# EAGLE design XBeeBreakOut (EAGLE 8.0.0)
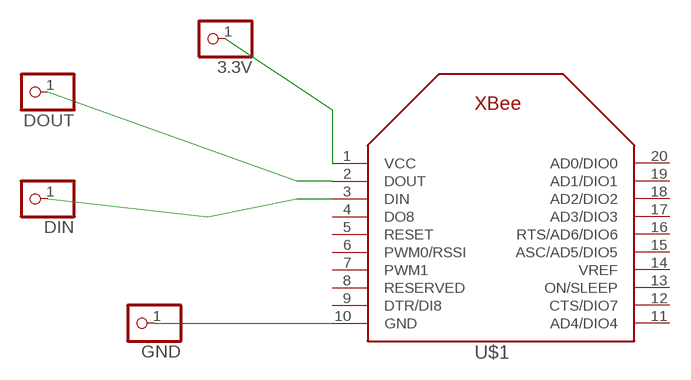
[diagram p0: schematic, sheet 1]

## Parts
3.3V  PINHD-1X1  [1X01]
DIN  PINHD-1X1  [1X01]
DOUT  PINHD-1X1  [1X01]
GND  PINHD-1X1  [1X01]
U$1  XBEE  [XBEE]

## Nets
DIN: DIN.1 U$1.3(DIN)
DOUT: DOUT.1 U$1.2(DOUT)
GND: GND.1 U$1.10(GND)
VCC: 3.3V.1 U$1.1(VCC)
Unconnected: U$1.4(DO8) U$1.5(RESET) U$1.6(PWM0/RSSI) U$1.7(PWM1) U$1.8(RESERVED) U$1.9(DTR/DI8) U$1.11(AD4/DIO4) U$1.12(CTS/DIO7) U$1.13(ON/SLEEP) U$1.14(VREF) U$1.15(ASC/AD5/DIO5) U$1.16(RTS/AD6/DIO6) U$1.17(AD3/DIO3) U$1.18(AD2/DIO2) U$1.19(AD1/DIO1) U$1.20(AD0/DIO0)

## Library data of the parts
3.3V DIN DOUT GND = adafruit:PINHD-1X1: Pin header 1x1 for 0.1" spacing With round pins
U$1 = adafruit:XBEE

## Board
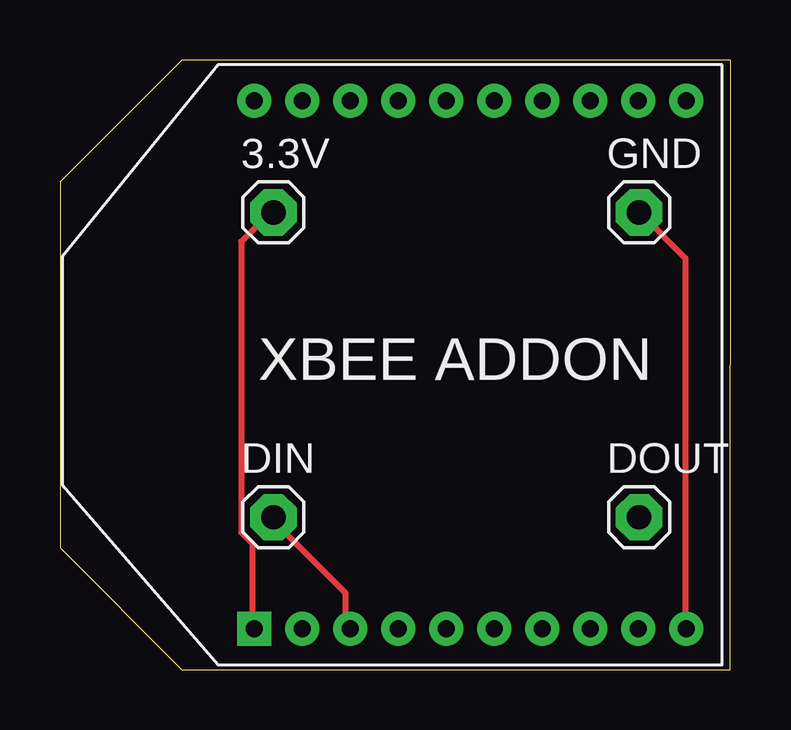
[diagram p1: board, top side]
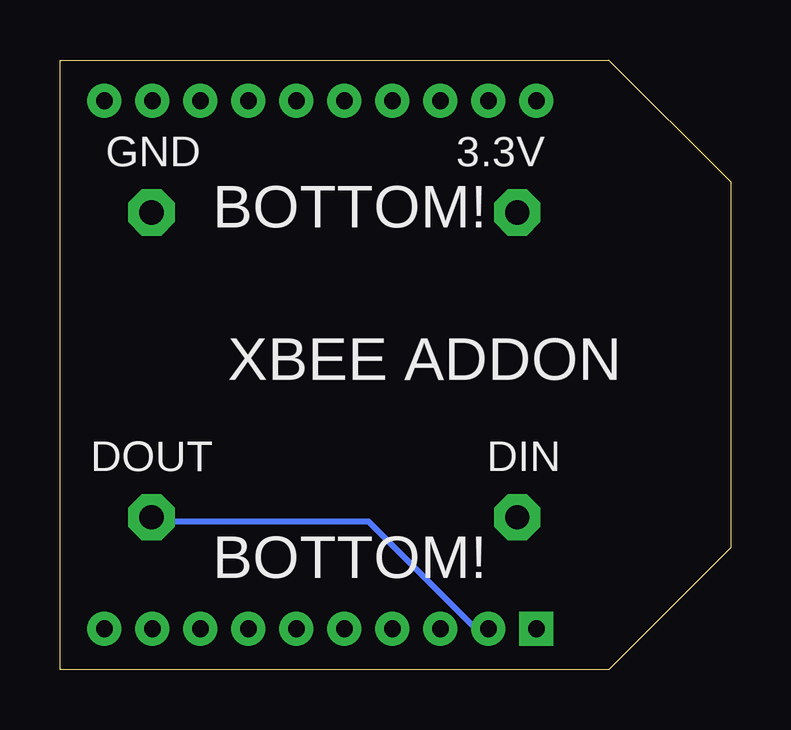
[diagram p2: board, bottom side, seen from below]

Size 27.94 x 25.4 mm. Coordinates in mm from the lower left corner, seen from the top.
Outline: 5.08,0 27.92,0 27.94,25.4 5.08,25.4 0,20.32 0,5.08 5.08,0
Copper layers (1*16): Top 0.035mm / dielectric 1.5mm / Bottom 0.035mm
Design rules "default": minimum track width 10mil, minimum drill 24mil, track to track 8mil, track to pad 8mil, pad to pad 8mil, via to via 8mil, smd to smd 8mil, copper to edge 40mil, drill to drill 8mil, minimum pad ring 10mil, minimum via ring 8mil, stop-mask expansion 4mil, vias tented up to drill 0mil, thermal gap 10mil

### Footprints (pad centres in the part's own frame; a part is rotated, then mirrored left to right if it is on the bottom)
1X01 = drill 1.016 pad 1.93 octagon: 1 0,0
XBEE = drill 0.7 pad 1.422 square: 1 -11,5.5 | drill 0.7 pad 1.422: 2 -11,3.5; 3 -11,1.5; 4 -11,-0.5; 5 -11,-2.5; 6 -11,-4.5; 7 -11,-6.5; 8 -11,-8.5; 9 -11,-10.5; 10 -11,-12.5; 11 11,-12.5; 12 11,-10.5; 13 11,-8.5; 14 11,-6.5; 15 11,-4.5; 16 11,-2.5; 17 11,-0.5; 18 11,1.5; 19 11,3.5; 20 11,5.5

### Placement (x,y rotation side)
3.3V  8.89,19.05 0 top
DIN  8.89,6.35 0 top
DOUT  24.13,6.35 0 top
GND  24.13,19.05 0 top
U$1  13.59,12.7 90 top

### Tracks (layer width: path | path; a pad name or v marks a point on that pad's centre or on a via)
DIN
  Top 0.254: U$1.3 11.89,1.83 11.89,3.2 8.91,6.17 DIN.1
DOUT
  Bottom 0.254: U$1.2 10.29,1.83 10.74,1.83 15.09,6.17 24,6.17 DOUT.1
GND
  Top 0.254: U$1.10 26.06,1.83 26.06,17.14 24.23,18.97 GND.1
VCC
  Top 0.254: U$1.1 8,1.83 8,5.26 7.54,5.71 7.54,17.83 8.69,18.97 3.3V.1

### Text on the board
tPlace: XBEE ADDON
bPlace: 3.3V | GND | BOTTOM! | XBEE ADDON | DIN | DOUT | BOTTOM!